# Altium schematic sheet 1_MCU.schdoc
size 307 x 218 mm; Symbol: Sheet-Symbol_A4; Device: Sheet-Symbol_A4; Company: 嘉立创EDA; Drawed: Fukui (Daniel) Yang; Version: V1.0; Page Size: A4; @Project Name: OptoGrid_V0.05; @Page Count: 2; @Update Date: 2025-09-04; @Create Date: 2025-07-05; @Schematic Name: OptoGrid_Main_V0.05; @Page No: 1; @Page Name: MCU; Title Block Position: 3; Width: 1170; Height: 825; Region Start: 1; X Region Count: 6; Y Region Count: 4; Blade Width: 10; @Board Name: OptoGrid_Main_V0.05; @Create Time: 17:38:21; @Update Time: 09:45:07
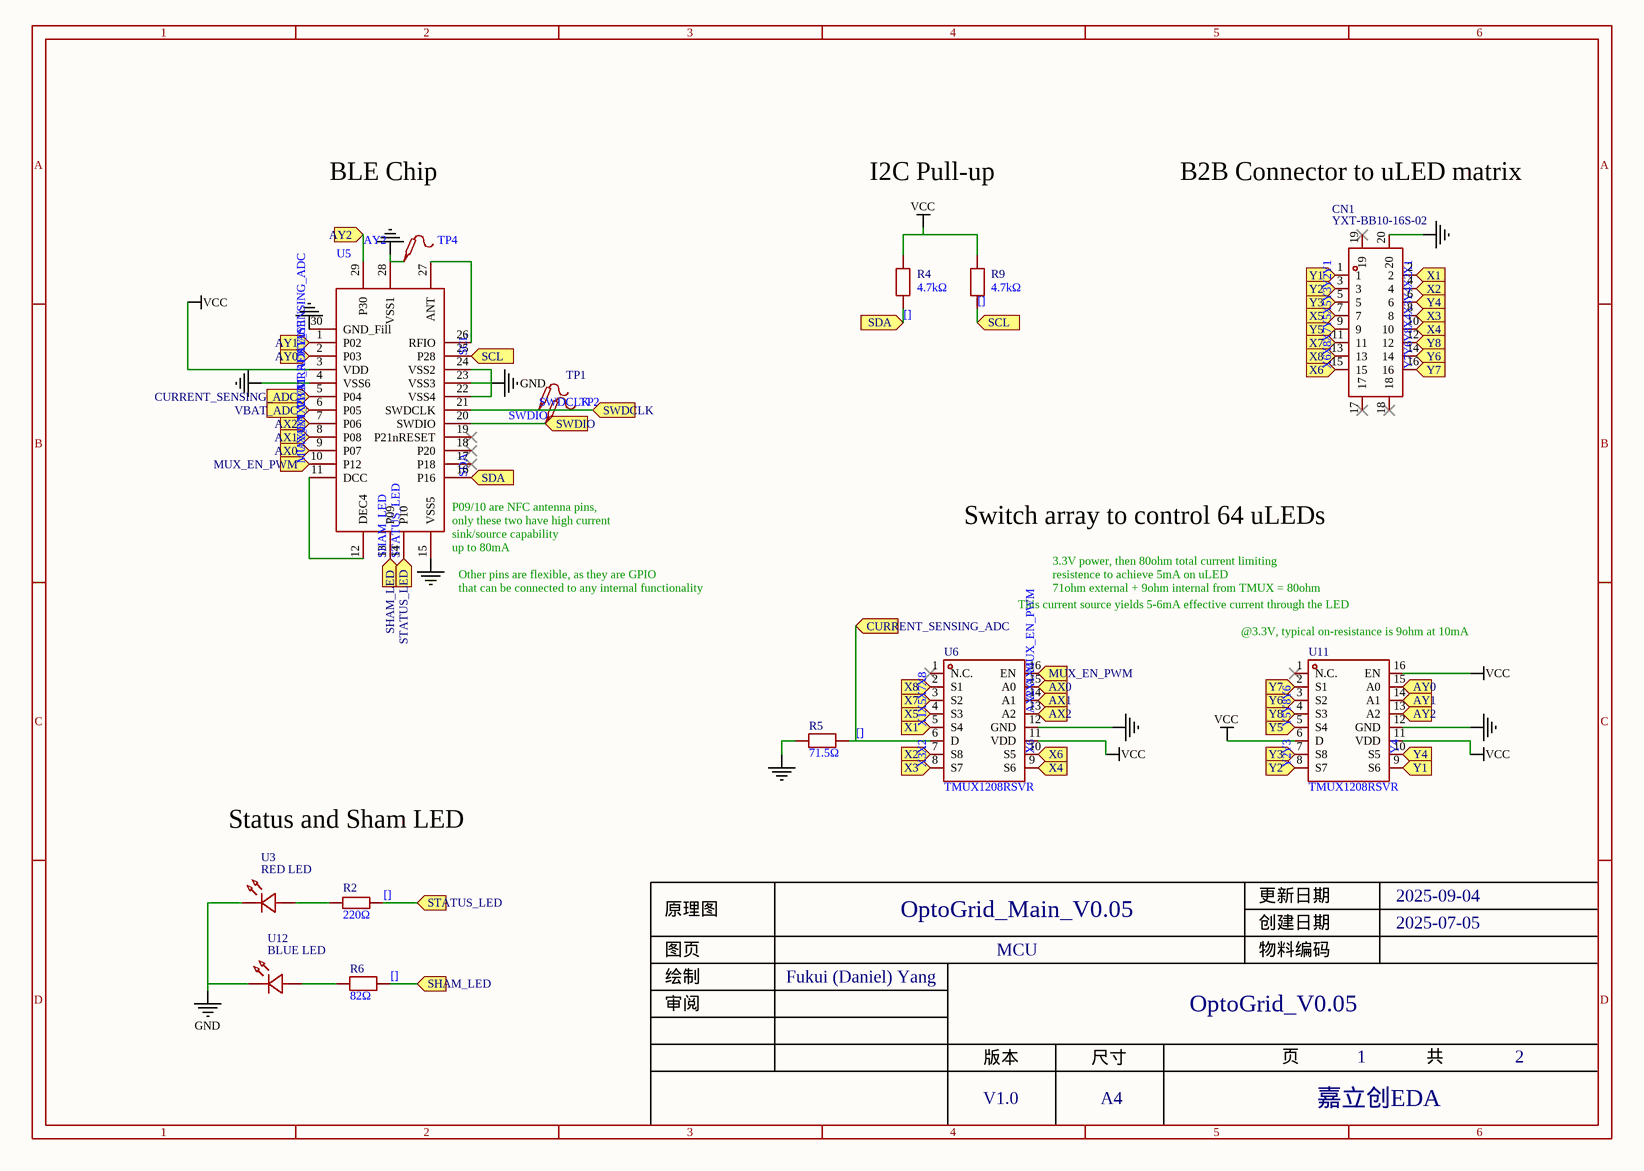
[diagram p0: 1_MCU.schdoc]

## Parts
CN1  YXT-BB10-16S-02  [CONN-SMD_YXT-BB10-16S-02]
R2  220Ω  [R0201]
R4  4.7kΩ  [R0201]
R5  71.5Ω  [R0201]
R6  82Ω  [R0201]
R9  4.7kΩ  [R0201]
TP1  (no value)  [Test-Point-0.5mm]
TP2  (no value)  [Test-Point-0.5mm]
TP4  (no value)  [Test-Point-0.5mm]
U3  RED LED  [BLUE_LED_KINGBRIGHT_0201]
U5  (no value)  [HY0020_footprint_NoFilling]
U6  TMUX1208RSVR  [UTQFN-16_L2.6-W1.8-P0.40-BL]
U11  TMUX1208RSVR  [UTQFN-16_L2.6-W1.8-P0.40-BL]
U12  BLUE LED  [BLUE_LED_KINGBRIGHT_0201]

## Ports
AX0 (in), AX1 (in), AX2 (in), AY0 (in), AY1 (in), AY2 (in), CURRENT_SENSING_ADC (in), MUX_EN_PWM (in), SCL (in), SDA (in), SHAM_LED (in), STATUS_LED (in), SWDCLK (in), SWDIO (in), VBAT_ADC (in), X1 (in), X2 (in), X3 (in), X4 (in), X5 (in), X6 (in), X7 (in), X8 (in), Y1 (in), Y2 (in), Y3 (in), Y4 (in), Y5 (in), Y6 (in), Y7 (in), Y8 (in)

## Nets
GND: CN1.20 R5.1 TP4.1 U3.1(K) U5.4(VSS6) U5.15(VSS5) U5.22(VSS4) U5.23(VSS3) U5.24(VSS2) U5.28(VSS1) U5.30(GND_Fill) U6.12(GND) U11.12(GND) U12.1(K)
VCC: R4.2 R9.2 U5.3(VDD) U6.11(VDD) U11.6(D) U11.11(VDD) U11.16(EN)
[]: R2.2 R4.1 R5.2 R6.2 R9.1 U5.5(P04) U5.13(P09) U5.14(P10) U5.16(P16) U5.25(P28) U6.6(D) ; port STATUS_LED, port SHAM_LED, port CURRENT_SENSING_ADC, port SCL, port SDA  [also labelled CURRENT_SENSING_ADC, SCL, SDA, SHAM_LED, STATUS_LED]
AX0: U5.9(P07) U6.15(A0) ; port AX0
AX1: U5.8(P08) U6.14(A1) ; port AX1
AX2: U5.7(P06) U6.13(A2) ; port AX2
AY0: U5.2(P03) U11.15(A0) ; port AY0
AY1: U5.1(P02) U11.14(A1) ; port AY1
AY2: U5.29(P30) U11.13(A2) ; port AY2
MUX_EN_PWM: U5.10(P12) U6.16(EN) ; port MUX_EN_PWM
SWDCLK: TP1.1 U5.21(SWDCLK) ; port SWDCLK
SWDIO: TP2.1 U5.20(SWDIO) ; port SWDIO
VBAT_ADC: U5.6(P05) ; port VBAT_ADC
X1: CN1.2 U6.5(S4) ; port X1
X2: CN1.4 U6.7(S8) ; port X2
X3: CN1.8 U6.8(S7) ; port X3
X4: CN1.10 U6.9(S6) ; port X4
X5: CN1.7 U6.4(S3) ; port X5
X6: CN1.15 U6.10(S5) ; port X6
X7: CN1.11 U6.3(S2) ; port X7
X8: CN1.13 U6.2(S1) ; port X8
Y1: CN1.1 U11.9(S6) ; port Y1
Y2: CN1.3 U11.8(S7) ; port Y2
Y3: CN1.5 U11.7(S8) ; port Y3
Y4: CN1.6 U11.10(S5) ; port Y4
Y5: CN1.9 U11.5(S4) ; port Y5
Y6: CN1.14 U11.3(S2) ; port Y6
Y7: CN1.16 U11.2(S1) ; port Y7
Y8: CN1.12 U11.4(S3) ; port Y8
NetR2_1: R2.1 U3.2(A)
NetR6_1: R6.1 U12.2(A)
NetU5_11: U5.11(DCC) U5.12(DEC4)
NetU5_26: U5.26(RFIO) U5.27(ANT)

Not connected (* = marked no-connect by the designer): CN1 17* 18* 19*; U5 17(P18)* 18(P20)* 19(P21nRESET)*; U6 1(N.C.)*; U11 1(N.C.)*

## Notes on the sheet
- BLE Chip
- I2C Pull-up
- B2B Connector to uLED matrix
- (near U5) P09/10 are NFC antenna pins,
  only these two have high current
  sink/source capability
  up to 80mA
- (near U5) Other pins are flexible, as they are GPIO
  that can be connected to any internal functionality
- Switch array to control 64 uLEDs
- (near U6) 3.3V power, then 80ohm total current limiting
  resistence to achieve 5mA on uLED
  71ohm external + 9ohm internal from TMUX = 80ohm
- This current source yields 5-6mA effective current through the LED
- (near U11) @3.3V, typical on-resistance is 9ohm at 10mA
- Status and Sham LED
- 1
- 2
- 3
- 4
- 5
- 6
- A
- B
- C
- 原理图
- OptoGrid_Main_V0.05
- 创建日期
- 更新日期
- 2025-09-04
- 2025-07-05
- 绘制
- 图页
- Fukui (Daniel) Yang
- MCU
- 物料编码
- D
- 审阅
- 版本
- 尺寸
- OptoGrid_V0.05
- 页
- 共
- V1.0
- A4
- 嘉立创EDA

## Library data of the parts
CN1 = YXT-BB10-16S-02: Manufacturer: YXT(益鑫通）; Add into BOM: yes; Symbol: YXT-BB10-16S-02; Device: YXT-BB10-16S-02; Supplier: LCSC; Supplier Part: C2763964; Manufacturer Part: YXT-BB10-16S-02; JLCPCB Part Class: Extended Part; Convert to PCB: yes; Origin Footprint: CONN-SMD_YXT-BB10-16S-02
R2 = RC0201FR-07220RL: Manufacturer: YAGEO(国巨); Add into BOM: yes; Tolerance: ±1%; Power(Watts): 50mW; Overload Voltage (Max): 25V; Temperature Coefficient: ±200ppm/℃; Symbol: RC0201FR-07220RL; Device: RC0201FR-07220RL; LCSC Part Name: 厚膜电阻 220Ω ±1% 50mW; Supplier Part: C274342; Manufacturer Part: RC0201FR-07220RL; Supplier Footprint: 0201; JLCPCB Part Class: 扩展库; Datasheet: https://atta.szlcsc.com/upload/public/pdf/source/20180821/C275644_0D56F95EFF785E7D9A1FEF436B37DA78.pdf; Supplier: LCSC; Convert to PCB: yes; Type: 厚膜电阻; Value: 220Ω; Operating Temperature Range: -55℃~+125℃
R4 R9 = AF0201FR-074K7L: Manufacturer: YAGEO(国巨); Add into BOM: yes; Tolerance: ±1%; Power(Watts): 50mW; Overload Voltage (Max): 25V; Temperature Coefficient: ±200ppm/℃; Symbol: AF0201FR-074K7L; Device: AF0201FR-074K7L; LCSC Part Name: 厚膜电阻 4.7kΩ ±1% 50mW; Supplier Part: C2105831; Manufacturer Part: AF0201FR-074K7L; Supplier Footprint: 0201; JLCPCB Part Class: 扩展库; Datasheet: https://atta.szlcsc.com/upload/public/pdf/source/20210712/C2105831_B7E5D2600BF229B29F1C9CE0CCE2B3D7.pdf; Supplier: LCSC; Convert to PCB: yes; Type: 厚膜电阻; Value: 4.7kΩ; Operating Temperature Range: -55℃~+125℃
R5 = 0201WMF715JTEE: Manufacturer: UNI-ROYAL(厚声); Add into BOM: yes; Tolerance: ±1%; Power(Watts): 50mW; Overload Voltage (Max): 25V; Temperature Coefficient: ±200ppm/℃; Symbol: 0201WMF715JTEE; Device: 0201WMF715JTEE; LCSC Part Name: 71.5Ω ±1% 50mW 厚膜电阻; Supplier Part: C423441; Manufacturer Part: 0201WMF715JTEE; Supplier Footprint: 0201; JLCPCB Part Class: 扩展库; Datasheet: https://atta.szlcsc.com/upload/public/pdf/source/20200306/C422600_1E6D84923E4A46A82E41ADD87F860B5C.pdf; Supplier: LCSC; Convert to PCB: yes; Type: 厚膜电阻; Value: 71.5Ω; Operating Temperature Range: -55℃~+155℃
R6 = NQ01WMJ0820TEE: Manufacturer: FH; Manufacturer Part: RC-01W82R0FT; Add into BOM: yes; Tolerance: ±5%; Power(Watts): 50mW; Overload Voltage (Max): 50V; Temperature Coefficient: ±200ppm/℃; Symbol: NQ01WMJ0820TEE; Device: NQ01WMJ0820TEE; LCSC Part Name: 82Ω ±5% 50mW; Supplier Part: C321062; Supplier Footprint: 0201; JLCPCB Part Class: 扩展库; Datasheet: https://atta.szlcsc.com/upload/public/pdf/source/20200826/C778391_130F7848FE812F64BEA6E556F7D5CD0C.pdf; Supplier: LCSC; Convert to PCB: yes; Value: 82Ω; Operating Temperature Range: -55℃~+155℃
TP1 TP2 TP4 = Test-Point: Add into BOM: yes; Symbol: Test-Point; Device: Test-Point; Convert to PCB: yes
U3 = APG0603CGC-TT: Manufacturer: Kingbright; Manufacturer Part: APG0603SURC-TT; Symbol: APG0603VBC-A1-5MAV; Add into BOM: yes; Device: APG0603CGC-TT; Supplier: LCSC; Supplier Part: C5356830; JLCPCB Part Class: Extended Part; Convert to PCB: yes; Origin Footprint: BLUE_LED_KINGBRIGHT_0201
U5 = HY0020: Add into BOM: yes; Symbol: HY0020; Device: HY0020; Convert to PCB: yes
U6 U11 = TMUX1208RSVR: Manufacturer: TI(德州仪器); Add into BOM: yes; Symbol: TMUX1208RSVR; Device: TMUX1208RSVR; LCSC Part Name: TMUX1208RSVR; Supplier Part: C2673274; Manufacturer Part: TMUX1208RSVR; Supplier Footprint: UTQFN-16(1.8x2.6); JLCPCB Part Class: 扩展库; Datasheet: https://www.ti.com/cn/lit/gpn/tmux1208; Supplier: LCSC; Convert to PCB: yes; Switch Circuit: -
U12 = APG0603CGC-TT: Manufacturer: Kingbright; Symbol: APG0603VBC-A1-5MAV; Add into BOM: yes; Device: APG0603CGC-TT; Supplier: LCSC; Supplier Part: C5846953; Manufacturer Part: APG0603VBC-A1-5MAV; JLCPCB Part Class: Extended Part; Convert to PCB: yes; Origin Footprint: BLUE_LED_KINGBRIGHT_0201